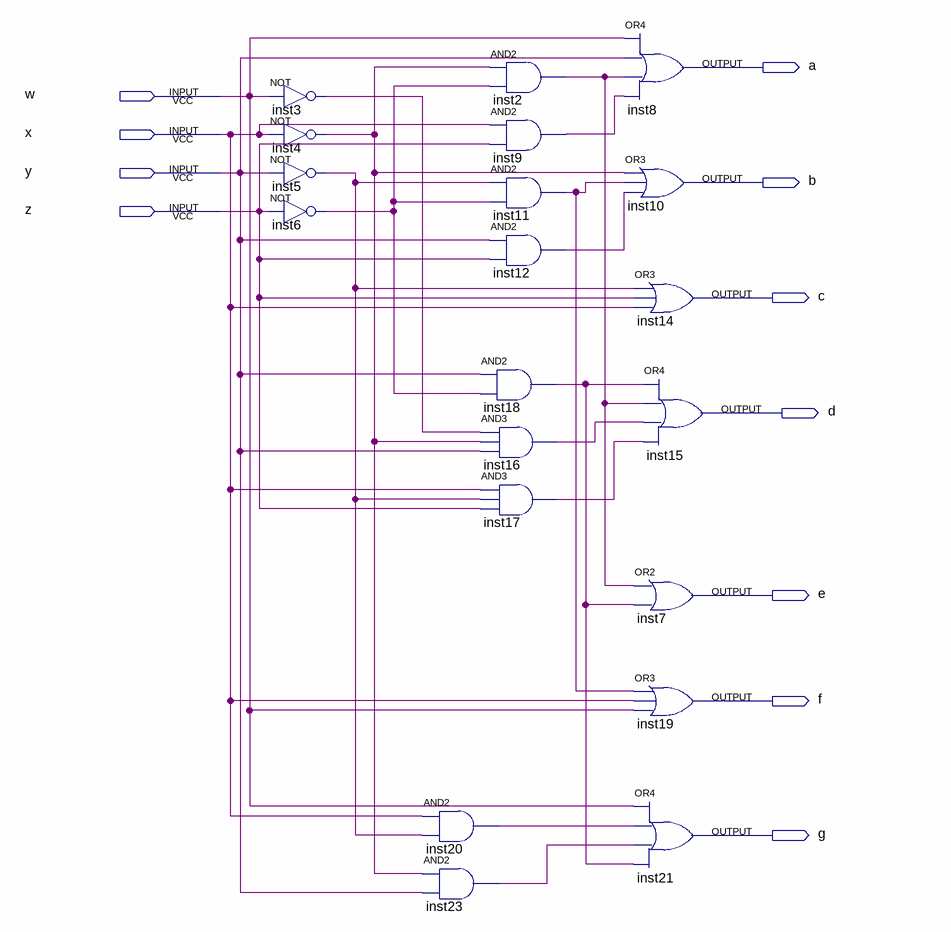
[diagram p0: schematic sheet]
// Quartus schematic seg_7.bdf as structural Verilog: 20 symbols, 11 pins
module seg_7 (
  input  w,
  input  x,
  input  y,
  input  z,
  output a,
  output b,
  output c,
  output d,
  output e,
  output f,
  output g
);

  wire inst2_out, inst3_out, inst4_out, inst5_out, inst6_out, inst9_out, inst11_out, inst12_out, inst16_out,
       inst17_out, inst18_out, inst20_out, inst23_out;

  not inst3 (inst3_out, w);
  not inst4 (inst4_out, x);
  not inst5 (inst5_out, y);
  not inst6 (inst6_out, z);
  and inst20 (inst20_out, x, inst5_out);
  and inst23 (inst23_out, inst4_out, y);
  and inst2 (inst2_out, inst4_out, inst6_out);
  and inst9 (inst9_out, x, z);
  and inst11 (inst11_out, inst5_out, inst6_out);
  and inst12 (inst12_out, y, z);
  and inst18 (inst18_out, y, inst6_out);
  and inst16 (inst16_out, inst3_out, inst4_out, y);
  and inst17 (inst17_out, x, inst5_out, z);
  or inst8 (a, w, y, inst2_out, inst9_out);
  or inst10 (b, inst4_out, inst11_out, inst12_out);
  or inst14 (c, inst5_out, z, x);
  or inst15 (d, inst18_out, inst2_out, inst16_out, inst17_out);
  or inst7 (e, inst2_out, inst18_out);
  or inst19 (f, inst11_out, x, w);
  or inst21 (g, w, inst20_out, inst23_out, inst18_out);
endmodule
